# EAGLE schematic APRS board R2 (EAGLE 6.4)
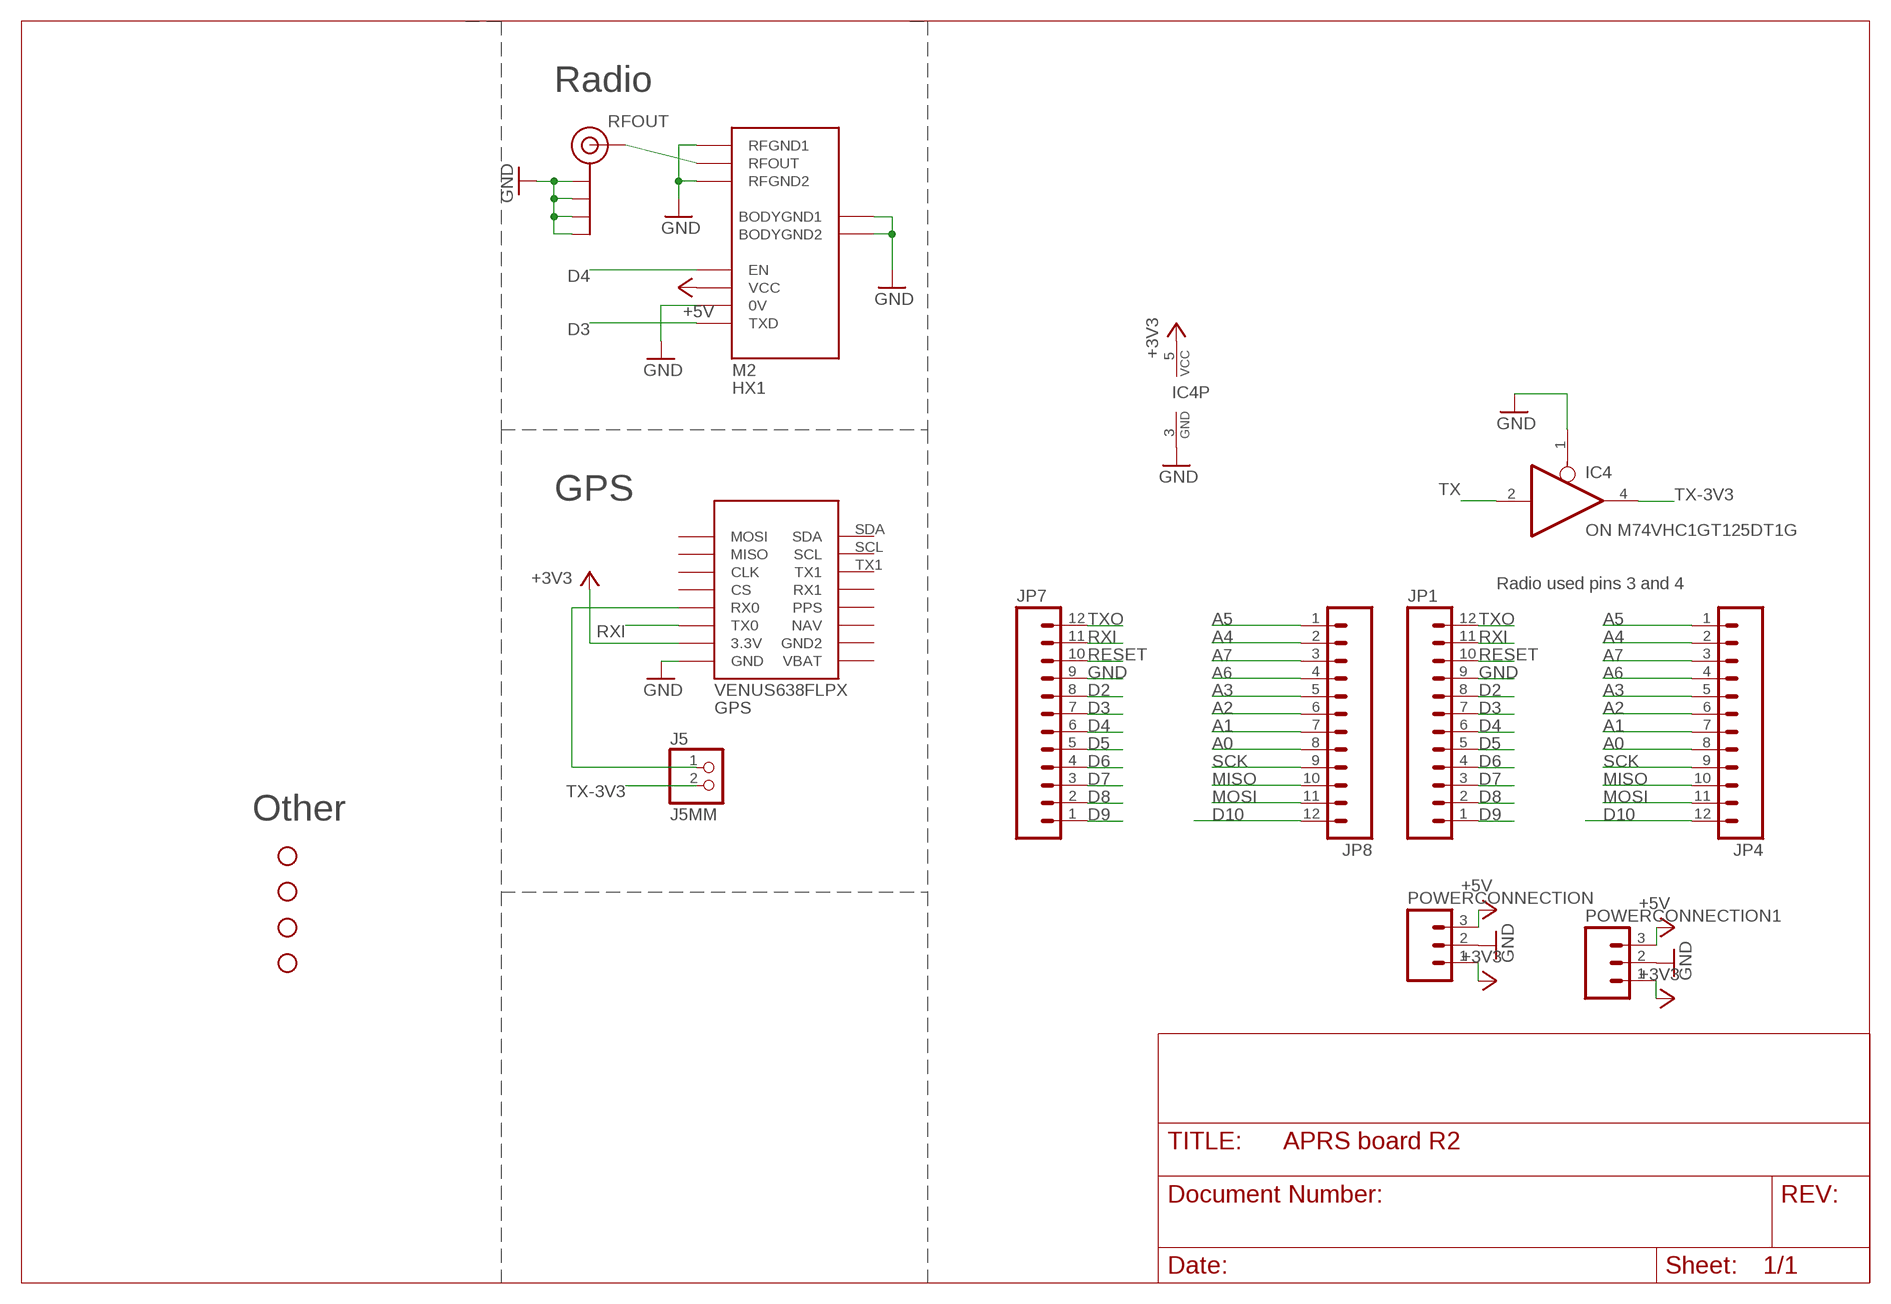
[diagram p0: schematic, sheet 1]

## Parts
GPS  VENUS638FLPX  [VENUS638FLPX]
IC4  ON M74VHC1GT125DT1G  74AHC1G125DBV  [SOT23-5]
J5  J5MM  PINHD-1X2  [1X02]
J$1  SMA_EDGE  [SMA-EDGE]
JP1  M12PTH  [1X12]
JP4  M12PTH  [1X12]
JP7  M12PTH  [1X12]
JP8  M12PTH  [1X12]
M2  HX1  [HX1]
POWERCONNECTION  M03PTH  [1X03]
POWERCONNECTION1  M03PTH  [1X03]
STANDOFF1  STAND-OFF  [STAND-OFF]
STANDOFF2  STAND-OFF  [STAND-OFF]
STANDOFF3  STAND-OFF  [STAND-OFF]
STANDOFF4  STAND-OFF  [STAND-OFF]

## Nets
+3V3: GPS.3.3V IC4.5(VCC) POWERCONNECTION1.1 POWERCONNECTION.1
+5V: M2.VCC POWERCONNECTION1.3 POWERCONNECTION.3
A0: JP4.8 JP8.8
A1: JP4.7 JP8.7
A2: JP4.6 JP8.6
A3: JP4.5 JP8.5
A4: JP4.2 JP8.2
A5: JP4.1 JP8.1
A6: JP4.4 JP8.4
A7: JP4.3 JP8.3
D2: JP1.8 JP7.8
D3: JP1.7 JP7.7 M2.TXD
D4: JP1.6 JP7.6 M2.EN
D5: JP1.5 JP7.5
D6: JP1.4 JP7.4
D7: JP1.3 JP7.3
D8: JP1.2 JP7.2
D9: JP1.1 JP7.1
D10: JP4.12 JP8.12
GND [vcc]: GPS.GND IC4.1(OE) IC4.3(GND) J$1.GND@0(GND) J$1.GND@1(GND) J$1.GND@2(GND) J$1.GND@3(GND) JP1.9 JP7.9 M2.0V M2.BODYGND1 M2.BODYGND2 M2.RFGND1 M2.RFGND2 POWERCONNECTION1.2 POWERCONNECTION.2
MISO: JP4.10 JP8.10
MOSI: JP4.11 JP8.11
N$2: GPS.RX0 J5.1
RESET: JP1.10 JP7.10
RFOUT [20]: J$1.SIG(SIGNAL) M2.RFOUT
RXI: GPS.TX0 JP1.11 JP7.11
SCK: JP4.9 JP8.9
TX: IC4.2(I)
TX-3V3: IC4.4(O) J5.2
TXO: JP1.12 JP7.12
Unconnected: GPS.CLK GPS.CS GPS.GND2 GPS.MISO GPS.MOSI GPS.NAV GPS.PPS GPS.RX1 GPS.SCL GPS.SDA GPS.TX1 GPS.VBAT

## Notes on the sheet
- Radio
- GPS
- Radio used pins 3 and 4
- Other

## Library data of the parts
GPS = trackuino:VENUS638FLPX
IC4 = 74xx-little-us:74*1G125: Single Bus Buffer Gate with 3-State Output
J5 = pinhead:PINHD-1X2: PIN HEADER
J$1 = SparkFun-Connectors:SMA_EDGE: SMA Antenna Connector End launch SMA connector. The paste layer has been removed so that the connector can be hand soldered onto the board after reflow.
JP1 JP4 JP7 JP8 = SparkFun:M12: Header 12 Standard 12-pin 0.1" header. Use with straight break away headers (SKU : PRT-00116), right angle break away headers (PRT-00553), swiss pins (PRT-00743), machine pins (PRT-00117), and female headers (PRT-00115).
M2 = trackuino:HX1
POWERCONNECTION POWERCONNECTION1 = SparkFun-Connectors:M03: Header 3 Standard 3-pin 0.1" header. Use with straight break away headers (SKU : PRT-00116), right angle break away headers (PRT-00553), swiss pins (PRT-00743), machine pins (PRT-00117), and female headers (PRT-00115). Molex polarized connector foot print use with SKU : PRT-08232 with associated crimp pins and housings.
STANDOFF1-STANDOFF4 = SparkFun-Electromechanical:STAND-OFF: #4 Stand Off This is the mechanical footprint for a #4 phillips button head screw. Use the keepout ring to avoid running the screw head into surrounding components. SKU : PRT-00447

## Net classes
1 vcc: width 0.254 mm
2 20: width 0.508 mm
3 30: width 0.762 mm